# Altium project SPB_FTLX_OUTCAM.PrjPCB
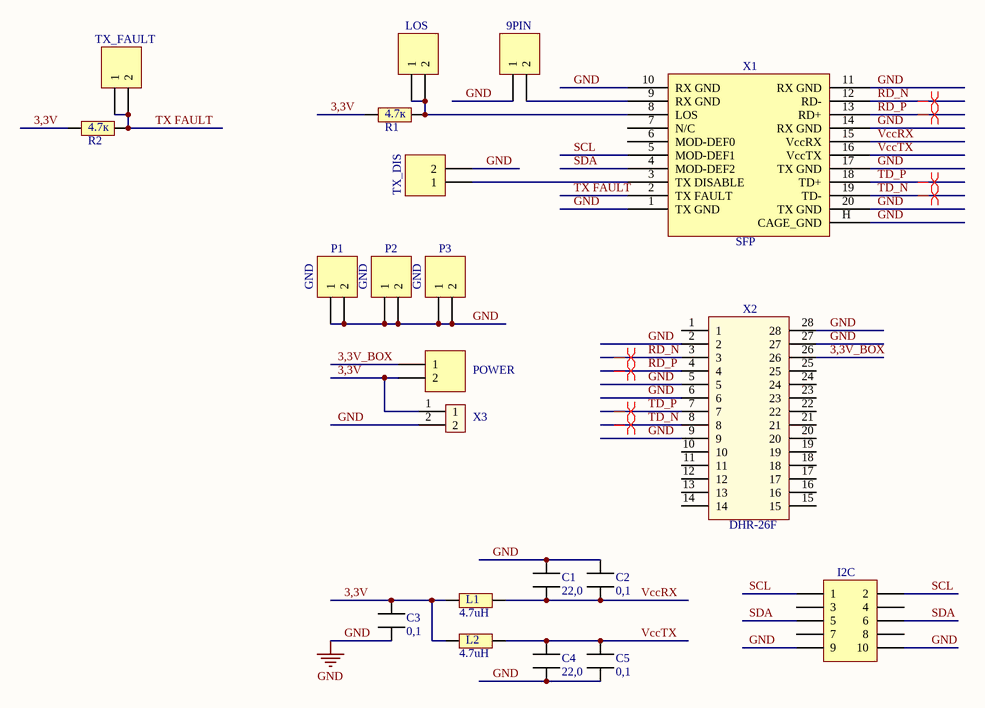
[diagram p0: Schematic.SchDoc]
1 sheet, 21 parts. Net scope: global (net labels, ports and power ports of the same name join across sheets).
Board file: PCB.PcbDoc

## Sheet Schematic.SchDoc
size A4

### Parts
9PIN  Header 2  [HDR1X2]  (value not drawn)
C1  22,0  [Cap_BIG]
C2  0,1  [CAP_SMALL]
C3  0,1  [CAP_SMALL]
C4  22,0  [Cap_BIG]
C5  0,1  [CAP_SMALL]
I2C  Header 5X2  [HDR2X5]  (value not drawn)
L1  4.7uH  [RES]
L2  4.7uH  [RES]
LOS  Header 2  [HDR1X2]  (value not drawn)
P1  GND  [HDR1X2]
P2  GND  [HDR1X2]
P3  GND  [HDR1X2]
POWER  Header 2  [HDR1X2]  (value not drawn)
R1  4.7к  [RES]
R2  4.7к  [RES]
TX_DIS  Header 2  [HDR1X2]  (value not drawn)
TX_FAULT  Header 2  [HDR1X2]  (value not drawn)
X1  SFP  [SFP-20pin]
X2  DHR-26F  [DHR-26F]
X3  KL_2  [KLEMMNIK_2]  (value not drawn)

### Nets
GND: 9PIN.1 C1.2 C2.2 C3.1 C4.1 C5.1 I2C.9 I2C.10 P1.1 P1.2 P2.1 P2.2 P3.1 P3.2 TX_DIS.2 X1.1(TX_GND) X1.10(RX_GND) X1.11(RX_GND) X1.14(RX_GND) X1.17(TX_GND) X1.20(TX_GND) X1.H(CAGE_GND) X2.2 X2.5 X2.6 X2.9 X2.27 X2.28 X3.2
3,3V: C3.2 L1.1 L2.1 POWER.2 R1.1 R2.1 X3.1
3,3V_BOX: POWER.1 X2.26
RD_N: X1.12(RD-) X2.3
RD_P: X1.13(RD+) X2.4
SCL: I2C.1 I2C.2 X1.5(MOD-DEF1)
SDA: I2C.5 I2C.6 X1.4(MOD-DEF2)
TD_N: X1.19(TD-) X2.8
TD_P: X1.18(TD+) X2.7
TX FAULT: R2.2 TX_FAULT.1 TX_FAULT.2 X1.2(TX_FAULT)
VccRX: C1.1 C2.1 L1.2 X1.15(VccRX)
VccTX: C4.2 C5.2 L2.2 X1.16(VccTX)
Net9PIN_2: 9PIN.2 X1.9(RX_GND)
NetLOS_1: LOS.1 LOS.2 R1.2 X1.8(LOS)
NetTX_DIS_1: TX_DIS.1 X1.3(TX_DISABLE)

Not connected (* = marked no-connect by the designer): I2C 3 4 7 8; X1 6(MOD-DEF0) 7(N/C); X2 1 10 11 12 13 14 15 16 17 18 19 20 21 22 23 24 25

### Layout directives
differential pair: RD_N, RD_P, TD_N, TD_P

### Library data of the parts
9PIN LOS P1-P3 POWER TX_DIS TX_FAULT = Header 2: Header, 2-Pin; LatestRevisionDate: 17-Jul-2002; LatestRevisionNote: Re-released for DXP Platform.; Publisher: Altium Limited
C1 C4 = CAP_BIG
C2 C3 C5 = CAP_SMALL
I2C = Header 5X2: Header, 5-Pin, Dual row; LatestRevisionDate: 17-Jul-2002; LatestRevisionNote: Re-released for DXP Platform.; Publisher: Altium Limited
L1 L2 R1 R2 = RES
X1 = SFP-20pin
X3 = KLEMMNIK_2